# Altium schematic sheet NFC名片.SchDoc
size A2
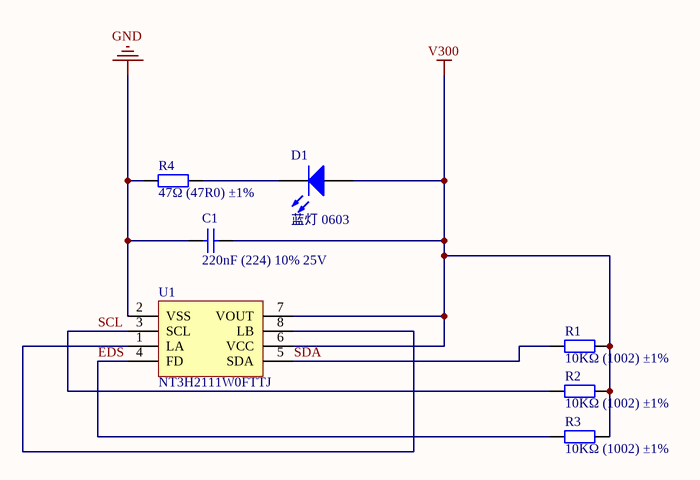
[diagram p0: NFC名片.SchDoc]

## Parts
C1  220nF (224) 10% 25V  [0603_C]
D1  蓝灯 0603  [0603_LED_S1]
R1  10KΩ (1002) ±1%  [0603_R]
R2  10KΩ (1002) ±1%  [0603_R]
R3  10KΩ (1002) ±1%  [0603_R]
R4  47Ω (47R0) ±1%  [0603_R]
U1  NT3H2111W0FTTJ  [TSSOP-8]

## Nets
GND: C1.1 R4.1 U1.2(VSS)
V300: C1.2 D1.A R1.2 R2.2 R3.2 U1.6(VCC) U1.7(VOUT)
EDS: R3.1 U1.4(FD)
SCL: R2.1 U1.3(SCL)
SDA: R1.1 U1.5(SDA)
NetD1_K: D1.K R4.2
NetU1_1: U1.1(LA) U1.8(LB)

## Library data of the parts
C1 = 0603 220nF (224) 10% 25V: 贴片电容; ComponentLink1Description: 供应商链接; ComponentLink1URL: http://www.szlcsc.com/product/details_21832.html; Package: 0603; Supplier: LC; SuppliersPartNumber: C21120
D1 = 0603 蓝灯: 发光二极管; ComponentLink1Description: 供应商链接; ComponentLink1URL: http://www.szlcsc.com/product/details_73150.html; Package: 0603; Supplier: LC; SuppliersPartNumber: C72041
R1-R3 = 0603 10KΩ (1002) 1%: 贴片电阻; ComponentLink1Description: 供应商链接; ComponentLink1URL: http://www.szlcsc.com/product/details_26547.html; Package: 0603; Supplier: LC; SuppliersPartNumber: C25804
R4 = 0603 47Ω (47R0) 1%: 贴片电阻; ComponentLink1Description: 供应商链接; ComponentLink1URL: http://www.szlcsc.com/product/details_23909.html; Package: 0603; Supplier: LC; SuppliersPartNumber: C23182
U1 = IR2101S